# EasyEDA schematic EasyEDA_single_chanel_pump.json
TITLE: Sheet_1; REV: 1.0; Date: 2022-06-07; Sheet: 1/1; Drawn By: aarkady; Company: Your Company
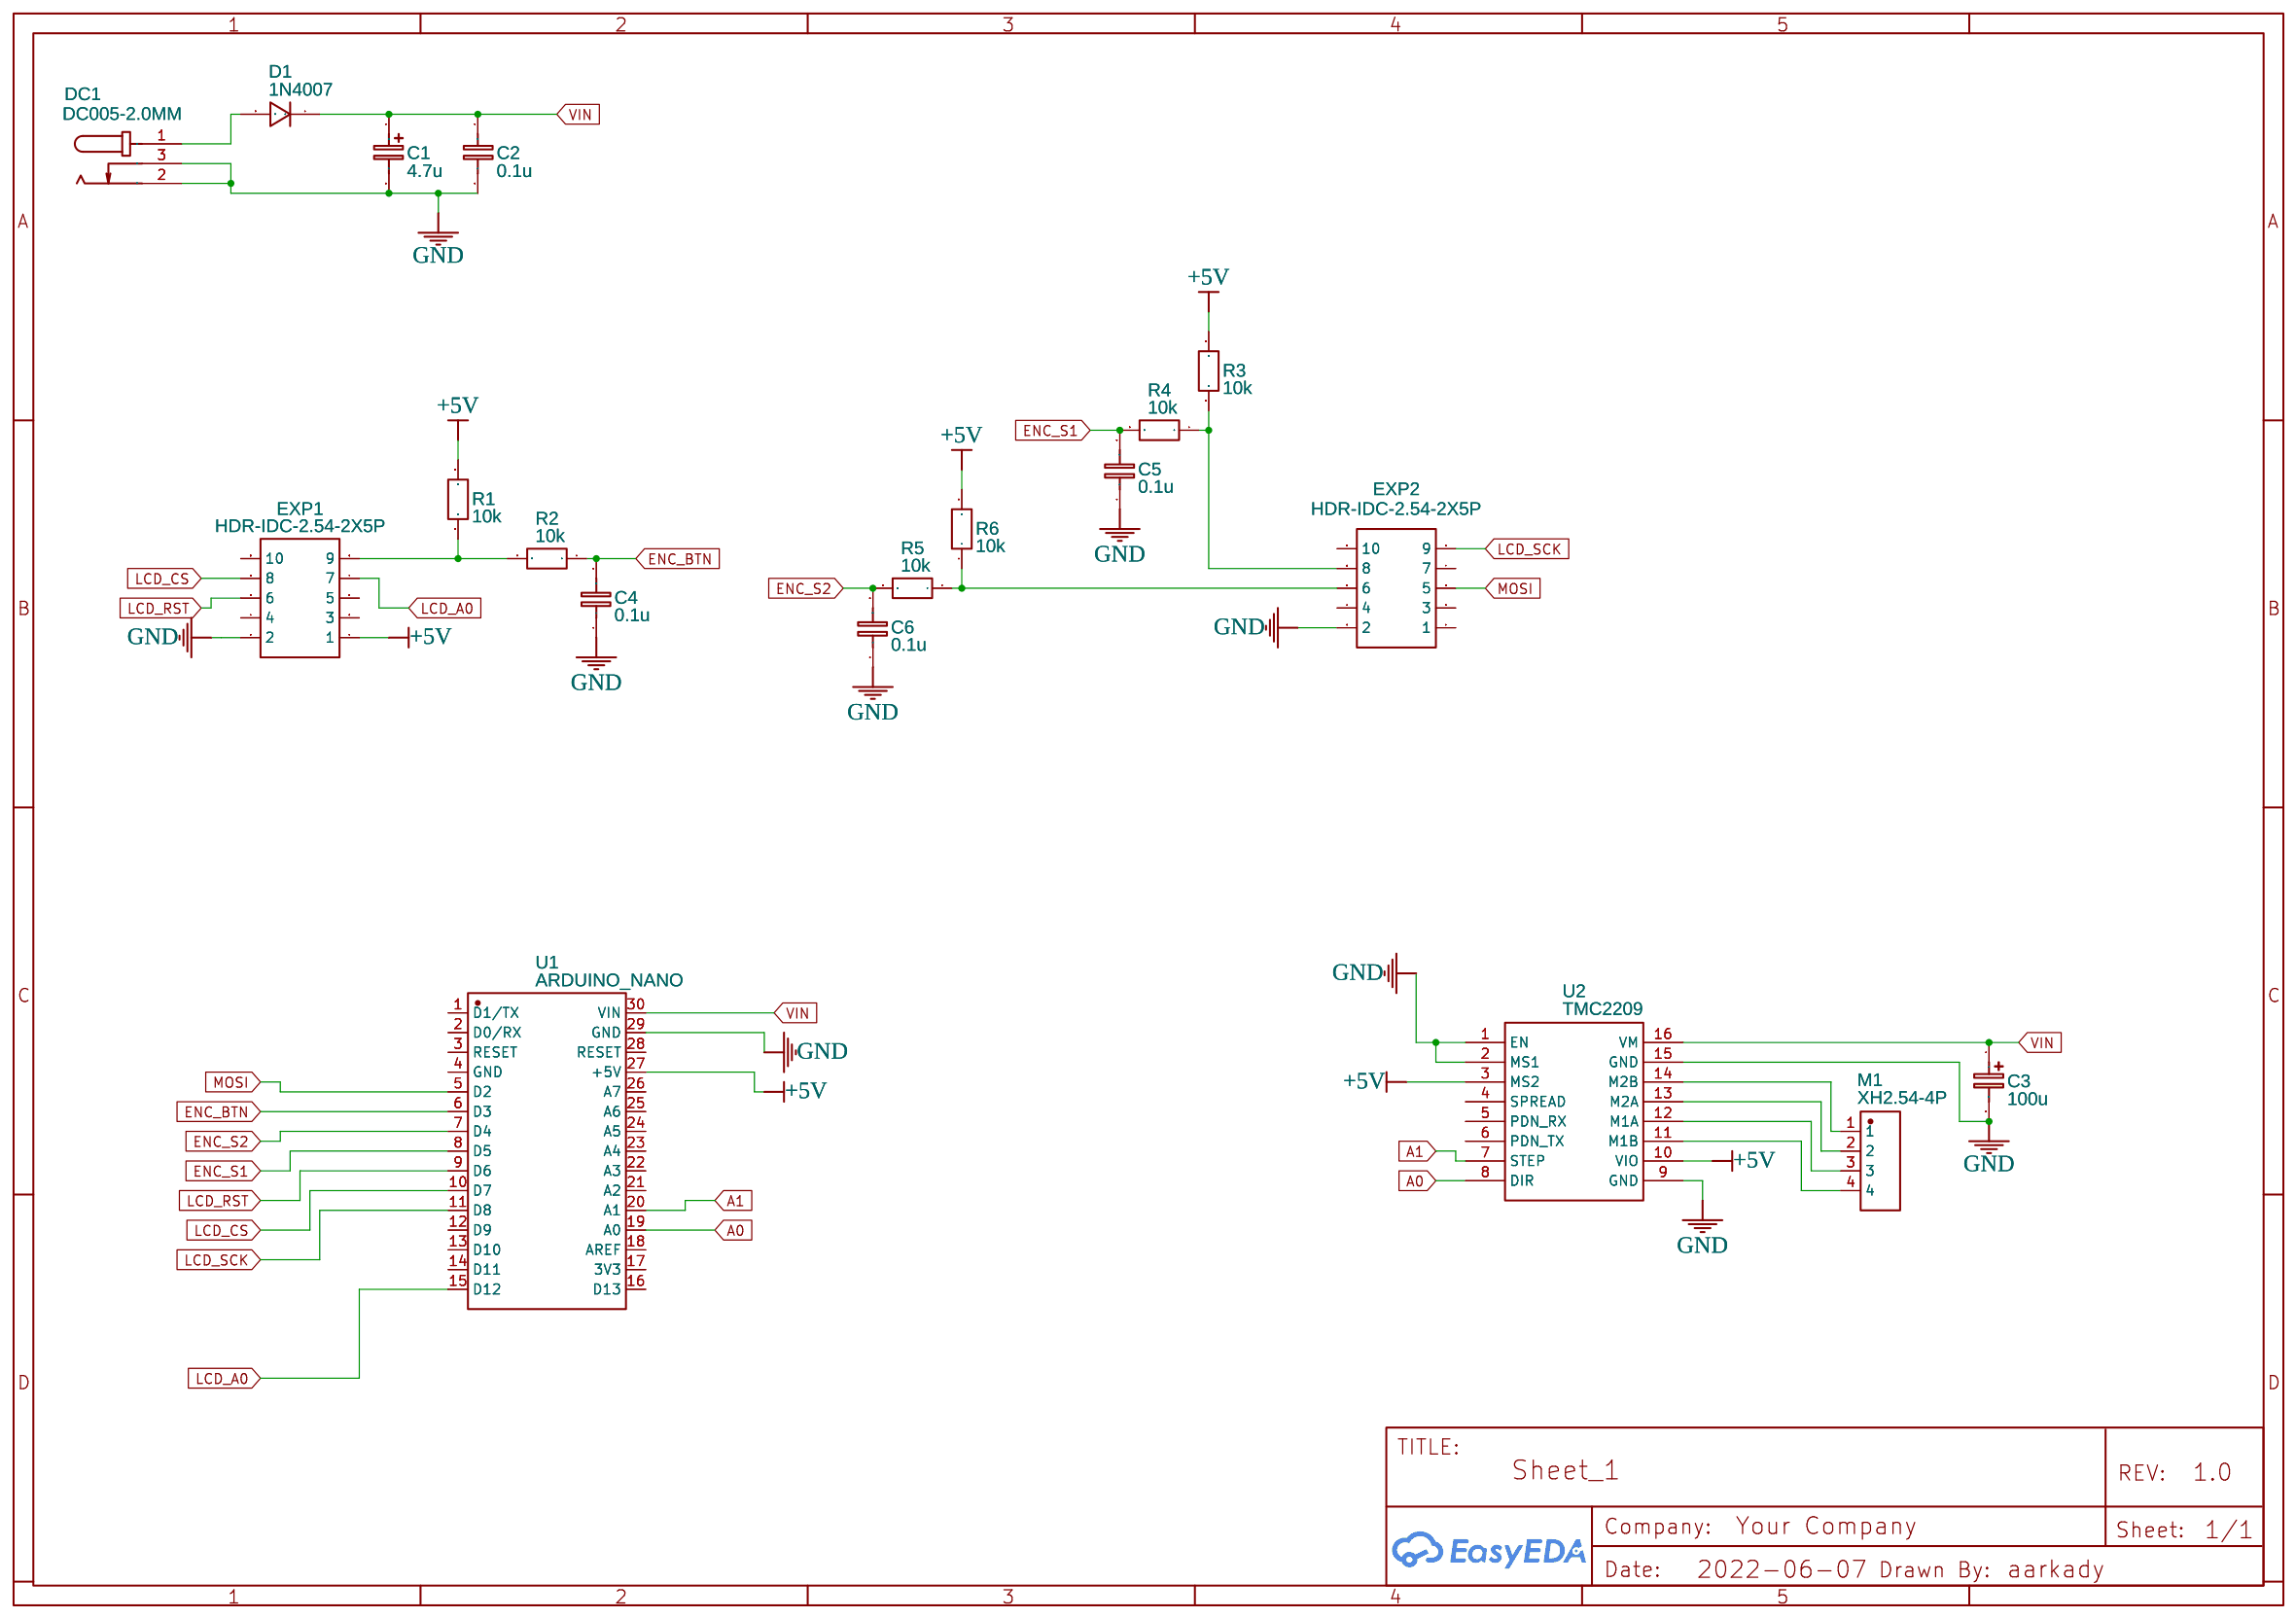
[diagram p0: schematic sheet]

## Parts
C1  4.7u  [CAP-D5.0×F2.0]
C2  0.1u  [RAD-0.1]
C3  100u  [CAP-D5.0×F2.0]
C4  0.1u  [RAD-0.1]
C5  0.1u  [RAD-0.1]
C6  0.1u  [RAD-0.1]
D1  1N4007  [DO-41_BD2.4-L4.7-P8.70-D0.9-RD]
DC1  DC005-2.0MM  [DC-IN-TH_DC005]
EXP1  HDR-IDC-2.54-2X5P  [IDC-TH_10P-P2.54_C5665]
EXP2  HDR-IDC-2.54-2X5P  [IDC-TH_10P-P2.54_C5665]
M1  XH2.54-4P  [CONN-TH_4P-P2.50-XH2.54-4P]
R1  10k  [R_AXIAL-0.3]
R2  10k  [R_AXIAL-0.3]
R3  10k  [R_AXIAL-0.3]
R4  10k  [R_AXIAL-0.3]
R5  10k  [R_AXIAL-0.3]
R6  10k  [R_AXIAL-0.3]
U1  ARDUINO_NANO  [COMM-TH_ARDUINO_NANO]
U2  TMC2209  [TMC2209]

## Library data of the parts
C1 C3 = CE_TH_D5.0×F2.0_EU: Contributor: LCEDA_Lib
C2 C4-C6 = C_RAD-0.2_EU: Contributor: LCEDA_Lib
D1 = 1N4007: Supplier: LCSC; Manufacturer: SEMTECH; Supplier Part: C106903; Contributor: LCEDA_Lib
DC1 = DC005-2.0MM: Supplier: LCSC; Manufacturer: SOFNG; Supplier Part: C111567
EXP1 EXP2 = HDR-IDC-2.54-2X5P: Supplier: LCSC; Manufacturer: BOOMELE; Manufacturer Part: IDC Box 2.54mm 2X5P; image: //image.lceda.cn/szlcsc/C5665.jpg; Supplier Part: C5665
M1 = XH2.54-4P: Supplier: LCSC; Supplier Part: C9900003326; Manufacturer: null; JLCPCB Part Class: Extended Part; Contributor: LCSC
R1-R6 = R_AXIAL-0.3_EU: Contributor: LCEDA_Lib
U1 = ARDUINO_NANO: Supplier: LCSC; Supplier Part: C9900017879; Manufacturer: null; JLCPCB Part Class: Extended Part; Contributor: lcsc
U2 = TMC2209: Contributor: Tatiana Avsievich

## Nets
+5V: EXP1.1 R1.2 R3.2 R6.2 U1.27(+5V) U2.3(MS2) U2.10(VIO)
GND: C1.2 C2.2 C3.2 C4.1 C5.1 C6.1 DC1.2 DC1.3 EXP1.2 EXP2.2 U1.29(GND) U2.1(EN) U2.2(MS1) U2.9(GND) U2.15(GND)
VIN: C1.1 C2.1 C3.1 D1.1 U1.30(VIN) U2.16(VM)
A0: U1.19(A0) U2.8(DIR)
A1: U1.20(A1) U2.7(STEP)
ENC_BTN: C4.2 R2.1 U1.6(D3)
ENC_S1: C5.2 R4.2 U1.8(D5)
ENC_S2: C6.2 R5.2 U1.7(D4)
LCD_A0: EXP1.7 U1.15(D12)
LCD_CS: EXP1.8 U1.10(D7)
LCD_RST: EXP1.6 U1.9(D6)
LCD_SCK: EXP2.9 U1.11(D8)
MOSI: EXP2.5 U1.5(D2)
Net-(D1-2): D1.2 DC1.1
Net-(EXP1-9): EXP1.9 R1.1 R2.2
Net-(EXP2-6): EXP2.6 R5.1 R6.1
Net-(EXP2-8): EXP2.8 R3.1 R4.1
Net-(M1-1): M1.1 U2.14(M2B)
Net-(M1-2): M1.2 U2.13(M2A)
Net-(M1-3): M1.3 U2.12(M1A)
Net-(M1-4): M1.4 U2.11(M1B)

Not connected (* = marked no-connect by the designer): EXP1 3 4 5 10; EXP2 1 3 4 7 10; U1 1(D1/TX) 2(D0/RX) 3(RESET) 4(GND) 12(D9) 13(D10) 14(D11) 16(D13) 17(3V3) 18(AREF) 21(A2) 22(A3) 23(A4) 24(A5) 25(A6) 26(A7) 28(RESET); U2 4(SPREAD) 5(PDN RX) 6(PDN TX)
